# EAGLE design UTAP2022_DAUGHTER_v1.1 (EAGLE 7.5.0)
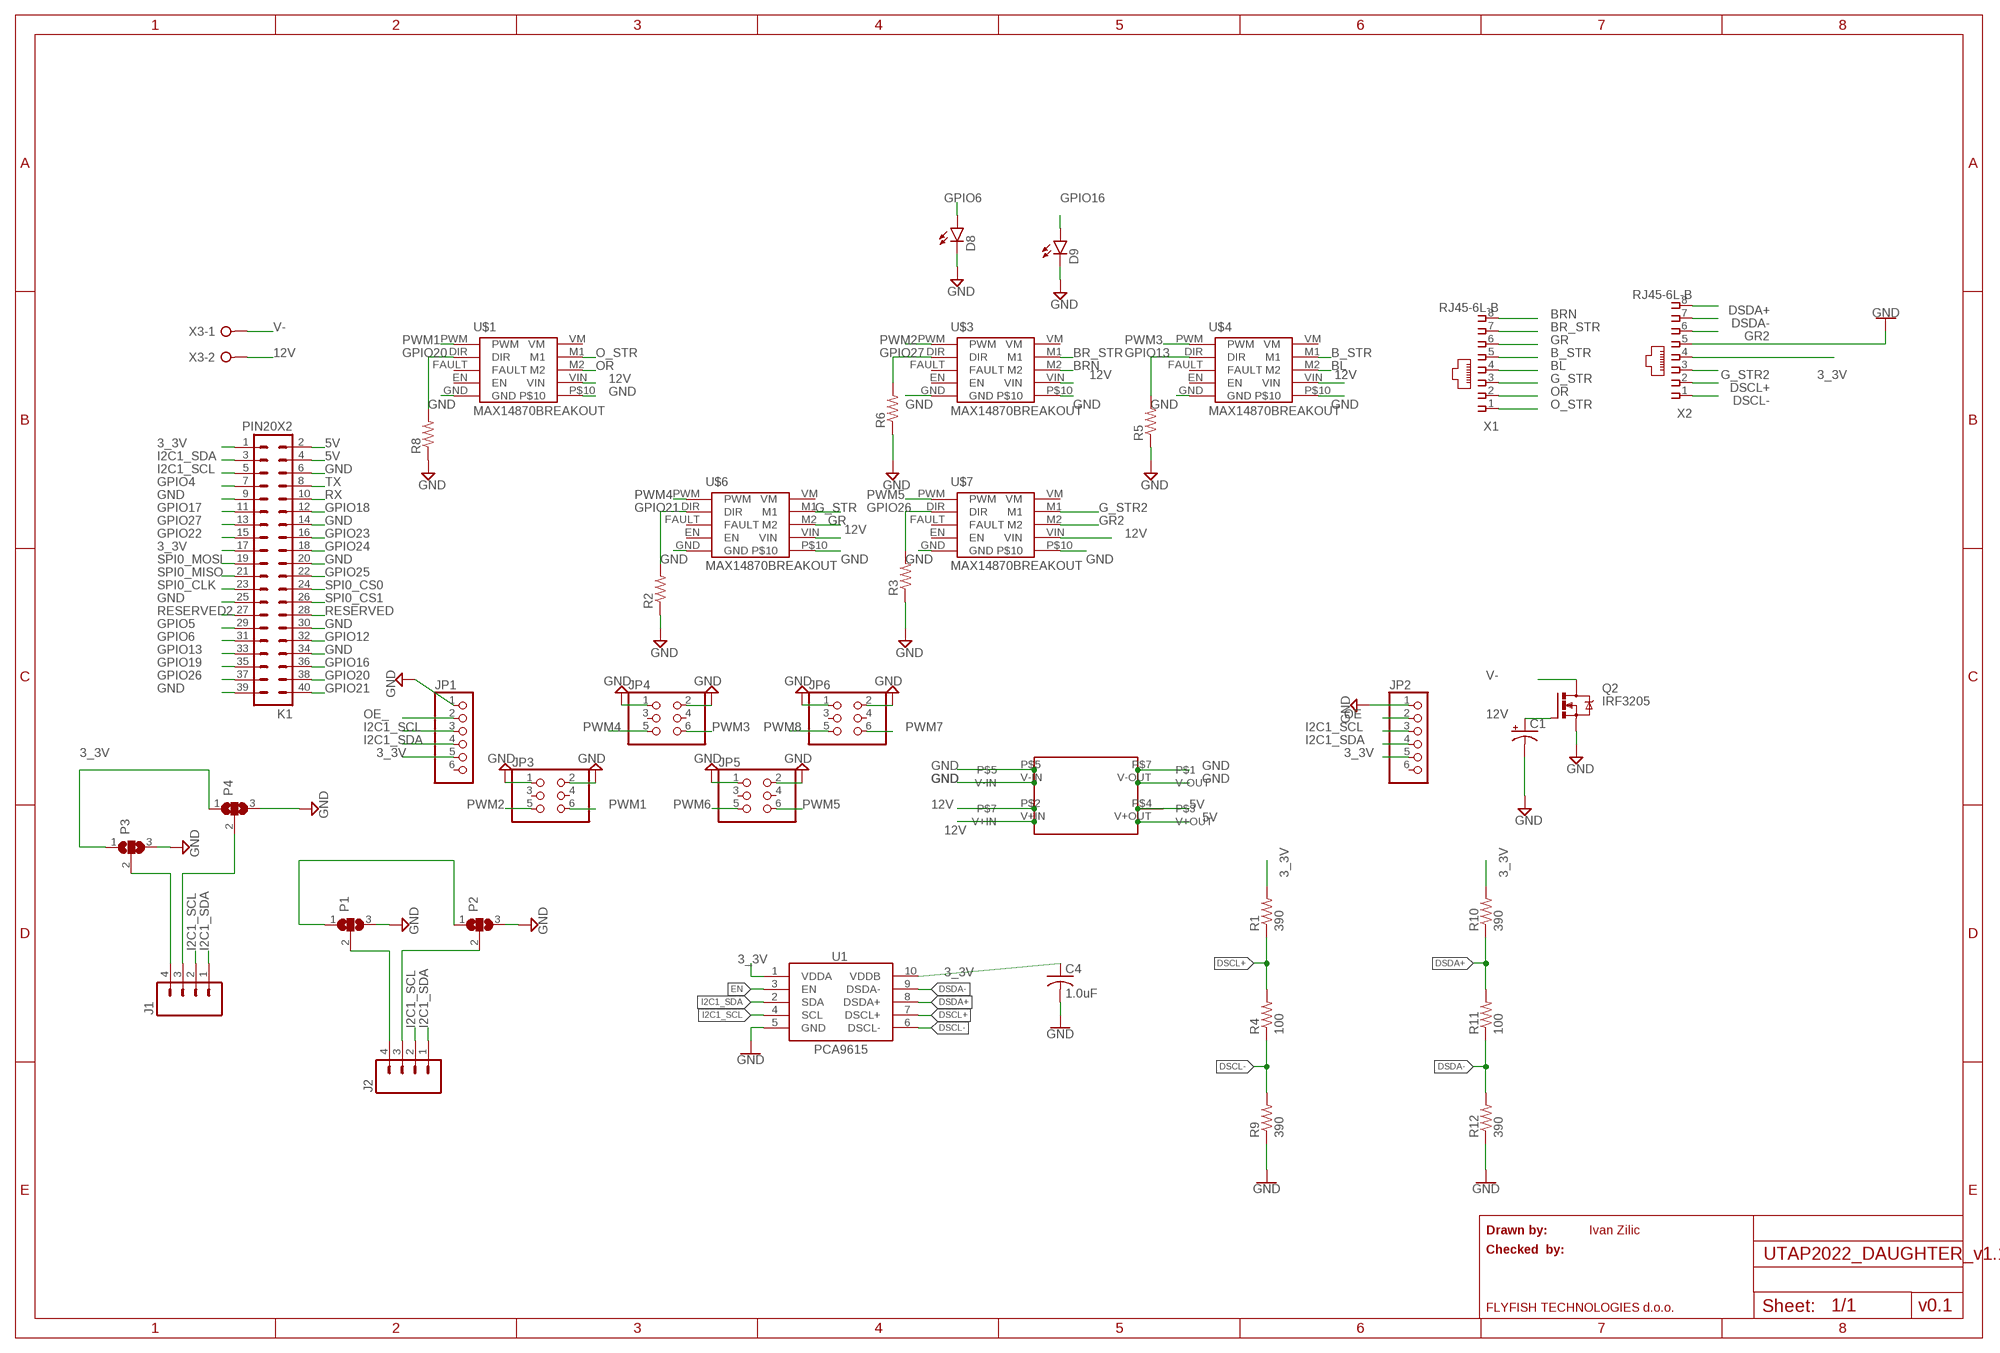
[diagram p0: schematic, sheet 1]

## Parts
C1  CAP_POLPTH1  [CPOL-RADIAL-100UF-25V]
C4  1.0uF  C-US050-024X044  [C050-024X044]
D8  LED5MM  [LED5MM]
D9  LED5MM  [LED5MM]
J1  M04PTH  [1X04]
J2  M04PTH  [1X04]
JP1  PINHD-1X6  [1X06]
JP2  PINHD-1X6  [1X06]
JP3  PINHD-2X3  [2X03]
JP4  PINHD-2X3  [2X03]
JP5  PINHD-2X3  [2X03]
JP6  PINHD-2X3  [2X03]
K1  PIN20X2  [PIN_20X2]
P1  SJ2W  [SJ_2]
P2  SJ2W  [SJ_2]
P3  SJ2W  [SJ_2]
P4  SJ2W  [SJ_2]
Q2  IRF3205  IRF540  [TO220BV]
R1  390  R-US_0204/7  [0204/7]
R2  R-US_0204/7  [0204/7]
R3  R-US_0204/7  [0204/7]
R4  100  R-US_0204/7  [0204/7]
R5  R-US_0204/7  [0204/7]
R6  R-US_0204/7  [0204/7]
R8  R-US_0204/7  [0204/7]
R9  390  R-US_0204/7  [0204/7]
R10  390  R-US_0204/7  [0204/7]
R11  100  R-US_0204/7  [0204/7]
R12  390  R-US_0204/7  [0204/7]
U1  PCA9615  [TSSOP10]
U$1  MAX14870BREAKOUT  [MAX14870_BREAKOUT]
U$3  MAX14870BREAKOUT  [MAX14870_BREAKOUT]
U$4  MAX14870BREAKOUT  [MAX14870_BREAKOUT]
U$6  MAX14870BREAKOUT  [MAX14870_BREAKOUT]
U$7  MAX14870BREAKOUT  [MAX14870_BREAKOUT]
U$9  MP1584EN  [BUCK_CONV]
X1  RJ45-6L-B  [RJ45-NO-SHIELD]
X2  RJ45-6L-B  [RJ45-NO-SHIELD]
X3  W237-02P  [W237-132]

## Nets
3_3V: C4.1 JP1.5 JP2.5 K1.1 K1.17 P1.1 P2.1 P3.1 P4.1 R1.2 R10.2 U1.1(VDDA) U1.10(VDDB) X2.4
5V [5V]: K1.2 K1.4 U$9.P$4 U$9.V+OUT
12V [POWER]: C1.1(+) Q2.G U$1.VIN U$3.VIN U$4.VIN U$6.VIN U$7.VIN U$9.P$2 U$9.V+IN X3.2
B_STR [MOTOR]: U$4.M1 X1.5
BL [MOTOR]: U$4.M2 X1.4
BR_STR [MOTOR]: U$3.M1 X1.7
BRN [MOTOR]: U$3.M2 X1.8
DSCL+: R1.1 R4.2 U1.7(DSCL+) X2.2
DSCL-: R4.1 R9.2 U1.6(DSCL-) X2.1
DSDA+: R10.1 R11.2 U1.8(DSDA+) X2.8
DSDA-: R11.1 R12.2 U1.9(DSDA-) X2.7
EN: U1.3(EN)
G_STR [MOTOR]: U$6.M1 X1.3
G_STR2 [MOTOR]: U$7.M1 X2.3
GND [POWER]: C1.2(-) C4.2 D8.K(C) D9.K(C) JP1.1 JP2.1 JP3.1 JP3.2 JP4.1 JP4.2 JP5.1 JP5.2 JP6.1 JP6.2 K1.6 K1.9 K1.14 K1.20 K1.25 K1.30 K1.34 K1.39 P1.3 P2.3 P3.3 P4.3 Q2.S R2.1 R3.1 R5.1 R6.1 R8.1 R9.1 R12.1 U1.5(GND) U$1.GND U$1.P$10 U$3.GND U$3.P$10 U$4.GND U$4.P$10 U$6.GND U$6.P$10 U$7.GND U$7.P$10 U$9.P$5 U$9.P$7 U$9.V-IN U$9.V-OUT X2.5
GPIO4: K1.7
GPIO5: K1.29
GPIO6: D8.A K1.31
GPIO12: K1.32
GPIO13: K1.33 R5.2 U$4.DIR
GPIO16: D9.A K1.36
GPIO17: K1.11
GPIO18: K1.12
GPIO19: K1.35
GPIO20: K1.38 R8.2 U$1.DIR
GPIO21: K1.40 R2.2 U$6.DIR
GPIO22: K1.15
GPIO23: K1.16
GPIO24: K1.18
GPIO25: K1.22
GPIO26: K1.37 R3.2 U$7.DIR
GPIO27: K1.13 R6.2 U$3.DIR
GR [MOTOR]: U$6.M2 X1.6
GR2 [MOTOR]: U$7.M2 X2.6
I2C1_SCL: J1.2 J2.2 JP1.3 JP2.3 K1.5 U1.4(SCL)
I2C1_SDA: J1.1 J2.1 JP1.4 JP2.4 K1.3 U1.2(SDA)
N$3: J1.4 P3.2
N$4: J1.3 P4.2
N$5: J2.4 P1.2
N$6: J2.3 P2.2
O_STR [MOTOR]: U$1.M1 X1.1
OE: JP2.2
OE_: JP1.2
OR [MOTOR]: U$1.M2 X1.2
PWM1: JP3.6 U$1.PWM
PWM2: JP3.5 U$3.PWM
PWM3: JP4.6 U$4.PWM
PWM4: JP4.5 U$6.PWM
PWM5: JP5.6 U$7.PWM
PWM6: JP5.5
PWM7: JP6.6
PWM8: JP6.5
RESERVED: K1.28
RESERVED2: K1.27
RX: K1.10
SPI0_CLK: K1.23
SPI0_CS0: K1.24
SPI0_CS1: K1.26
SPI0_MISO: K1.21
SPI0_MOSI: K1.19
TX: K1.8
V- [POWER]: Q2.D X3.1
Unconnected: JP1.6 JP2.6 JP3.3 JP3.4 JP4.3 JP4.4 JP5.3 JP5.4 JP6.3 JP6.4 U$1.EN U$1.FAULT U$1.VM U$3.EN U$3.FAULT U$3.VM U$4.EN U$4.FAULT U$4.VM U$6.EN U$6.FAULT U$6.VM U$7.EN U$7.FAULT U$7.VM

## Notes on the sheet
- Drawn by: | Ivan Zilic
- Checked  by:
- FLYFISH TECHNOLOGIES d.o.o. | v0.1

## Library data of the parts
C1 = SparkFun-Passives:CAP_POL: Capacitor Polarized These are standard SMD and PTH capacitors. Normally 10uF, 47uF, and 100uF in electrolytic and tantalum varieties. Always verify the external diameter of the through hole cap, it varies with capacity, voltage, and manufacturer. The EIA devices should be standard.
C4 = rcl:C-US: CAPACITOR, American symbol
D8 D9 = SparkFun-LED:LED: LEDs Standard schematic elements and footprints for 5mm, 3mm, 1206, and 0603 sized LEDs. 5mm - Spark Fun Electronics SKU : COM-00529 (and others)
J1 J2 = SparkFun-Connectors:M04: Header 4 Standard 4-pin 0.1" header. Use with straight break away headers (SKU : PRT-00116), right angle break away headers (PRT-00553), swiss pins (PRT-00743), machine pins (PRT-00117), and female headers (PRT-00115). Molex polarized connector foot print use with SKU : PRT-08231 with associated crimp pins and housings. 1MM SMD Version SKU: PRT-10208; PROD_ID: CONN-09696
JP1 JP2 = pinhead:PINHD-1X6: PIN HEADER
JP3-JP6 = pinhead:PINHD-2X3: PIN HEADER
K1 = FLYFISH:PIN20X2
P1-P4 = jumper:SJ2W: SMD solder JUMPER
Q2 = transistor-power:IRF540: HEXFET Power MOSFET
R1-R6 R8-R12 = resistor:R-US_: RESISTOR, American symbol
U1 = SparkFun-IC-Comms:PCA9615: Differential I2C Bus Buffer Datasheet <https://www.nxp.com/docs/en/data-sheet/PCA9615.pdf>; PROD_ID: IC-13899
U$1 U$3 U$4 U$6 U$7 = MAX14870_BREAKOUT:MAX14870BREAKOUT
U$9 = MP1584EN:MP1584EN
X1 X2 = con-tycoelectronics:RJ45: CORCOM Modular RJ Jacks No Shield Source: www.tycoelectronics.com .. ENG_DS_1654001_1099_RJ_L_0507.pdf; MPN: RJ45-6L-B; OC_FARNELL: unknown; OC_NEWARK: 16R6090
X3 = con-wago-508:W237-02P: WAGO SREW CLAMP; OC_FARNELL: unknown; OC_NEWARK: unknown

## Net classes
0 default: width 0.254 mm, clearance 0.254 mm
1 POWER: width 2.032 mm, clearance 0.254 mm
2 MOTOR: width 1.016 mm, clearance 0.254 mm
3 5V: width 0.508 mm, clearance 0.254 mm

## Board
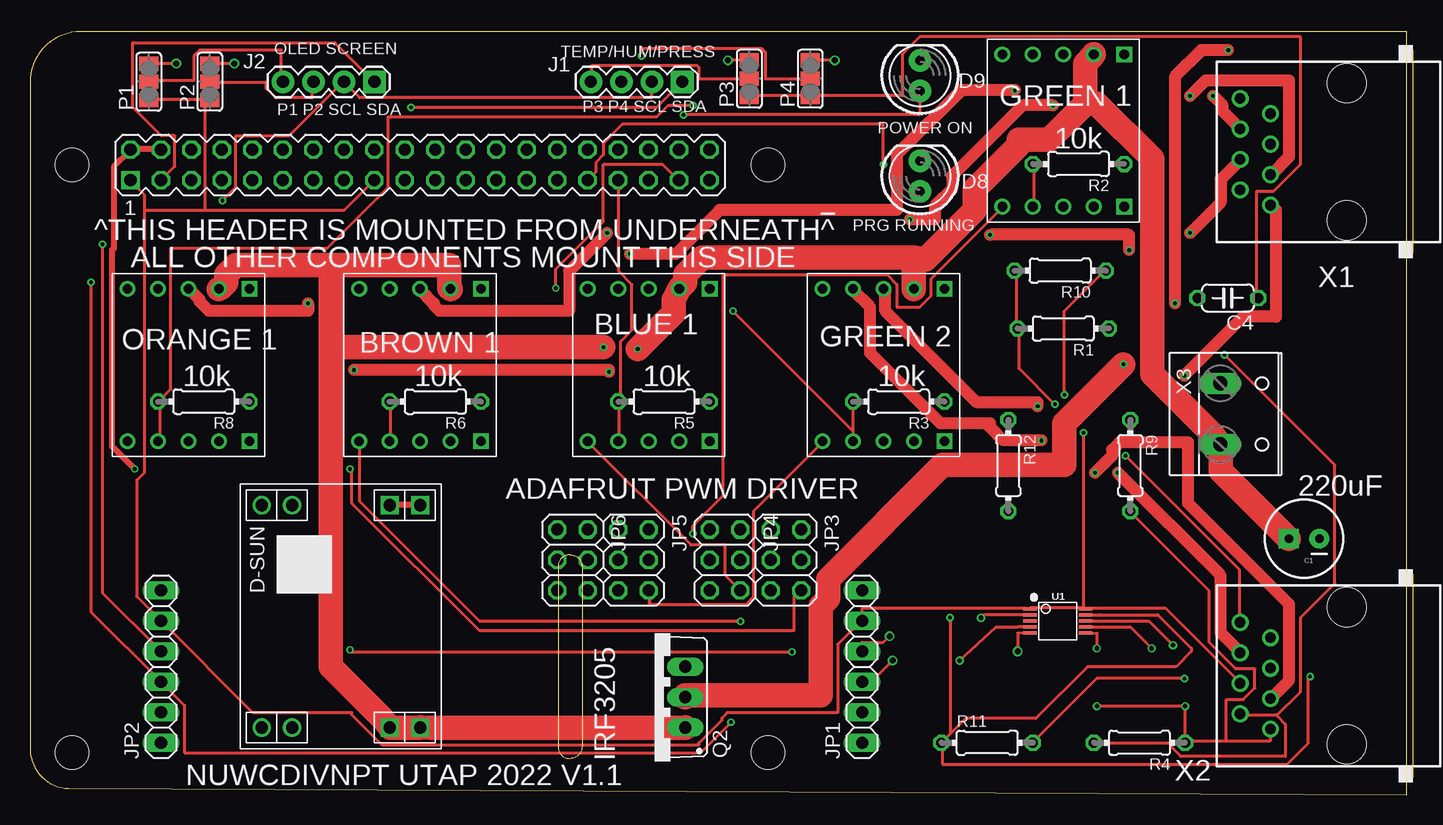
[diagram p1: board, top side]
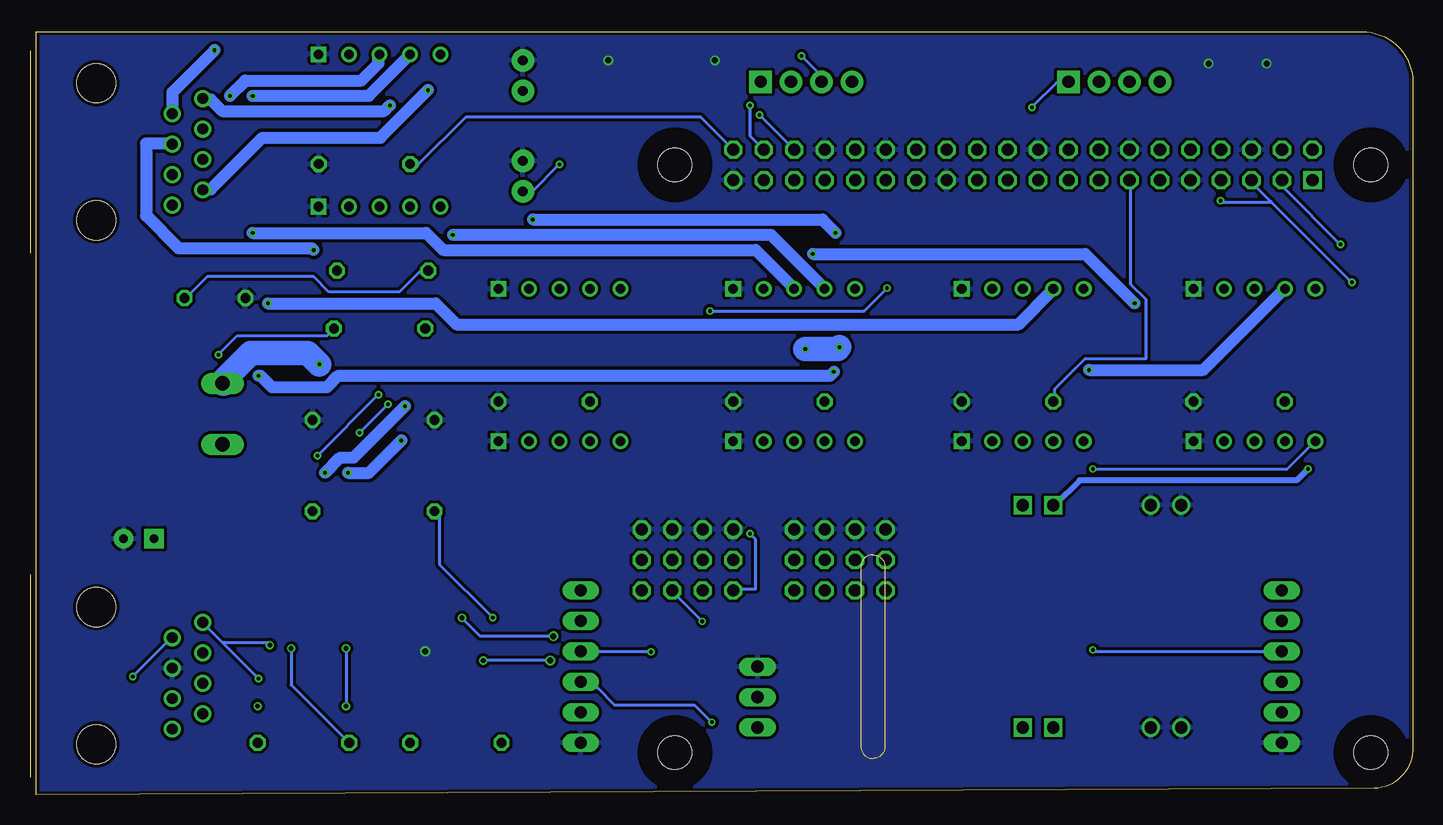
[diagram p2: board, bottom side, seen from below]

Size 114.72 x 63.62 mm. Coordinates in mm from the lower left corner, seen from the top.
Outline: 114.72,0 114.72,63.62 4.24,63.62 arc90 0,59.38 0,3.98 arc90 3.21,0.51 114.72,0
Copper layers (1*16): Top 0.035mm / dielectric 1.5mm / Bottom 0.035mm
Design rules "ITEADstudio_DRC *": minimum track width 6mil, minimum drill 12mil, track to track 6mil, track to pad 6mil, pad to pad 6mil, via to via 6mil, smd to smd 0mil, copper to edge 11mil, drill to drill 11mil, minimum pad ring 10mil, minimum via ring 6mil, stop-mask expansion 2mil, vias tented up to drill 100mil, thermal gap 10mil
Holes 2.8 mm at 3.5,3.5 3.5,52.5 61.5,52.5 61.5,3.5
tRestrict: area 1.9,51 to 5,54; area 60,51 to 63,54; area 60,1.9 to 63,5; area 1.9,1.9 to 5,5
bRestrict: area 1.9,1.9 to 5,5; area 1.9,51 to 5,54; area 60,1.9 to 63,5; area 60,51 to 63,54
Milling: 6 lines

### Footprints (pad centres in the part's own frame; a part is rotated, then mirrored left to right if it is on the bottom)
CPOL-RADIAL-100UF-25V = drill 0.7 pad 1.651 square: 1 1.27,0 | drill 0.7 pad 1.651: 2 -1.27,0
C050-024X044 = drill 0.813 octagon: 1 -2.54,0; 2 2.54,0
LED5MM = drill 0.813 pad 1.88: A -1.27,0; K 1.27,0
1X04 = drill 1.016 pad 1.88 square: 1 0,0 | drill 1.016 pad 1.88: 2 2.54,0; 3 5.08,0; 4 7.62,0
1X06 = drill 1.016 long: 1 -6.35,0; 2 -3.81,0; 3 -1.27,0; 4 1.27,0; 5 3.81,0; 6 6.35,0
2X03 = drill 1.016 octagon: 1 -2.54,-1.27; 2 -2.54,1.27; 3 0,-1.27; 4 0,1.27; 5 2.54,-1.27; 6 2.54,1.27
PIN_20X2 = drill 1.016 square: 1 -24.13,-1.27 | drill 1.016 octagon: 2 -24.13,1.27; 3 -21.59,-1.27; 4 -21.59,1.27; 5 -19.05,-1.27; 6 -19.05,1.27; 7 -16.51,-1.27; 8 -16.51,1.27; 9 -13.97,-1.27; 10 -13.97,1.27; 11 -11.43,-1.27; 12 -11.43,1.27; 13 -8.89,-1.27; 14 -8.89,1.27; 15 -6.35,-1.27; 16 -6.35,1.27; 17 -3.81,-1.27; 18 -3.81,1.27; 19 -1.27,-1.27; 20 -1.27,1.27; 21 1.27,-1.27; 22 1.27,1.27; 23 3.81,-1.27; 24 3.81,1.27; 25 6.35,-1.27; 26 6.35,1.27; 27 8.89,-1.27; 28 8.89,1.27; 29 11.43,-1.27; 30 11.43,1.27; 31 13.97,-1.27; 32 13.97,1.27; 33 16.51,-1.27; 34 16.51,1.27; 35 19.05,-1.27; 36 19.05,1.27; 37 21.59,-1.27; 38 21.59,1.27; 39 24.13,-1.27; 40 24.13,1.27
SJ_2 = smd 1.168 x 1.6: 1 -1.524,0; 2 0,0; 3 1.524,0
TO220BV = drill 1.016 long: D 0,-2.54; G -2.54,-2.54; S 2.54,-2.54
0204/7 = drill 0.813 octagon: 1 -3.81,0; 2 3.81,0
TSSOP10 = smd 1.1 x 0.25: 1 -2.259,1.018; 2 -2.259,0.517; 3 -2.259,0.018; 4 -2.259,-0.482; 5 -2.259,-0.988; 6 2.366,-0.988; 7 2.366,-0.482; 8 2.366,0.018; 9 2.366,0.517; 10 2.366,1.018
MAX14870_BREAKOUT = drill 0.8: DIR -6.35,2.54; EN -6.35,-2.54; FAULT -6.35,0; M1 6.35,2.54; M2 6.35,0; PWM -6.35,5.08; VIN 6.35,-2.54; VM 6.35,5.08 | drill 0.8 square: GND -6.35,-5.08; P$10 6.35,-5.08
BUCK_CONV = drill 1.016 square: P$2 1.778,4.318; P$4 20.32,4.318; V+IN 1.778,1.778; V+OUT 20.32,1.778 | drill 1.016: P$5 1.778,14.986; P$7 20.32,14.986; V-IN 1.778,12.446; V-OUT 20.32,12.446
RJ45-NO-SHIELD = drill 0.9 pad 1.4: 1 -4.445,6.35; 2 -3.175,8.89; 3 -1.905,6.35; 4 -0.635,8.89; 5 0.635,6.35; 6 1.905,8.89; 7 3.175,6.35; 8 4.445,8.89 | hole 3.251: -5.715,0; 5.715,0
W237-132 = drill 1.194 long: 1 -2.54,-0.635; 2 2.54,-0.635

### Placement (x,y rotation side)
C1  106.17,21.34 180 top
C4  99.82,41.4 180 top
D8  74.17,51.56 90 top
D9  74.17,59.94 90 top
J1  54.36,59.44 180 top
J2  28.7,59.44 180 top
JP1  69.34,10.67 90 top
JP2  10.92,10.67 90 top
JP3  62.99,19.56 270 top
JP4  57.91,19.56 270 top
JP5  50.29,19.56 270 top
JP6  45.21,19.56 270 top
K1  32.5,52.5 0 top
P1  9.91,59.44 90 top
P2  14.99,59.44 90 top
P3  59.94,59.69 90 top
P4  65.02,59.69 90 top
Q2  52.07,8.13 90 top
R1  86.11,38.86 180 top
R2  87.38,52.58 180 top
R3  72.39,32.77 180 top
R4  92.46,4.32 180 top
R5  52.83,32.77 180 top
R6  33.78,32.77 180 top
R8  14.48,32.77 180 top
R9  91.69,27.43 270 top
R10  85.85,43.69 180 top
R11  79.76,4.32 0 top
R12  81.53,27.43 270 top
U1  85.6,14.48 0 top
U$1  13.21,35.81 90 top
U$3  32.51,35.81 90 top
U$4  51.56,35.81 90 top
U$6  86.11,55.37 90 top
U$7  71.12,35.81 90 top
U$9  34.29,3.81 90 top
X1  109.73,53.59 90 top
X2  109.73,9.91 90 top
X3  99.82,31.75 270 top

### Tracks (layer width: path | path; a pad name or v marks a point on that pad's centre or on a via)
3_3V  (via drill 0.3)
  Top 0.254: P1.1 10,57.94 14.92,57.94 P2.1 14.92,57.78 14.61,57.47 14.61,48.74 | 9.53,48.74 9.53,50.01 8.41,51.12 K1.1 | 9.53,48.74 9.53,26.83 8.89,26.19 8.89,16.51 JP2.5 18.57,6.83 26.83,6.83 26.83,6.67 29.37,4.13 55.72,4.13 55.72,4.29 57.63,6.19 57.63,6.35 58.1,6.83 67.31,6.83 67.31,12.54 69.22,14.45 JP1.5 69.37,14.61 69.37,15.56 82.93,15.56 U1.1 83.34,15.56 87.79,15.56 | 9.53,48.74 14.61,48.74 | 14.61,48.74 26.19,48.74 28.57,51.12 K1.17 | 87.79,15.56 87.95,15.56 U1.10 | X2.4 100.81,9.37 94.61,15.56 88.11,15.56 U1.10 | P3.1 60.01,58.26 64.93,58.26 P4.1 65.09,58.26 72.71,58.26 72.71,61.75 74.14,63.18 105.89,63.18 105.89,52.55 103.66,50.32 102.23,50.32 102.23,41.43 C4.1 | R10.2 82.23,43.5 82.23,38.89 R1.2 82.39,38.73 82.39,35.56 v85.41,32.54 | v87.79,30.16 87.79,15.56 | 87.79,15.56 U1.10
  Bottom 0.254: C4.1 102.23,41.43 100.49,43.18 91.6,43.18 90.33,41.91 84.45,41.91 82.71,43.66 82.07,43.66 R10.2 | v85.41,32.54 v87.79,30.16
5V  (via drill 0.3)
  Top 0.508: U$9.V+OUT U$9.P$4 | K1.4 10.79,53.82 8.41,53.82 K1.2 8.26,53.66 6.99,52.39 6.99,45.56 6.83,45.4 6.83,29.05 v8.73,27.15
  Bottom 0.508: v8.73,27.15 9.68,26.19 27.78,26.19 29.84,24.13 U$9.P$4
12V  (via drill 0.3)
  Top 2.032: 25.08,44.13 34.92,44.13 34.92,42.23 U$3.VIN | 25.08,44.13 17.14,44.13 16.35,43.34 16.35,42.7 15.88,42.23 U$1.VIN | 30,5.56 32.38,5.56 U$9.V+IN 33.5,5.56 54.61,5.56 Q2.G | 30,5.56 U$9.P$2 | 25.08,37.31 25.08,10.64 29.37,6.35 30,5.56 | 25.08,37.31 25.08,44.13 | C1.1 104.78,21.43 99.22,26.99 99.22,29.21 X3.2 98.58,30 93.5,35.08 93.5,53.02 88.9,57.63 87.95,57.63 | 73.66,44.77 56.04,44.77 54.61,43.34 54.61,42.7 54.13,42.23 U$4.VIN 53.66,41.27 53.66,40.16 v50.64,37.15 | U$7.VIN 73.66,44.77 | 87.95,57.63 87.95,60.96 88.58,61.59 U$6.VIN | 87.95,57.63 84.93,54.61 82.39,54.61 82.39,54.13 78.74,50.48 78.74,48.74 74.61,44.61 73.66,44.77 | v47.78,37.31 25.08,37.31
  Bottom 2.032: v47.78,37.31 47.94,37.15 v50.64,37.15
B_STR  (via drill 0.3)
  Top 1.016: v80.01,46.67 91.6,46.67 v91.6,45.4
  Bottom 1.016: v80.01,46.67 53.5,46.67 49.05,42.23 U$4.M1 | v91.6,45.4 91.76,45.56 102.87,45.56 105.57,48.26 105.57,54.29 103.5,54.29 X1.5
BL  (via drill 0.3)
  Top 1.016: v96.68,46.83 99.22,49.37 99.22,51.28 100.81,52.86 X1.4
  Bottom 1.016: v96.68,46.83 82.23,46.83 80.8,45.4 54.77,45.4 51.59,42.23 U$4.M2
BR_STR  (via drill 0.3)
  Top 1.016: v95.41,40.96 95.41,59.85 97.63,62.07 v99.85,62.07
  Bottom 1.016: v95.41,40.96 81.44,40.96 79.69,39.21 32.86,39.21 30,42.07 U$3.M1 | v99.85,62.07 103.35,58.58 103.35,56.83 X1.7
BRN  (via drill 0.3)
  Top 1.016: v48.1,46.83 44.93,43.66 44.93,40.32 34.13,40.32 33.66,40.8 33.66,40.96 32.54,42.07 U$3.M2 | v73.34,47.94 75.41,47.94 75.41,49.05 76.83,50.48 76.83,51.59 82.71,57.47 v85.25,57.47
  Bottom 1.016: v48.1,46.83 49.21,47.94 v73.34,47.94 | v85.25,57.47 85.72,56.99 99.22,56.99 100.17,57.94 100.81,57.94 X1.8
DSCL+  (via drill 0.3, 0.38)
  Top 0.254: 103.9,6.59 103.82,6.67 100.97,6.67 X2.2 | 103.9,6.59 104.62,5.87 104.62,3.17 95.89,3.17 95.09,3.97 95.09,4.29 88.74,4.29 R4.2 | v99.54,36.67 108.74,27.46 108.74,17.62 105.89,14.76 105.89,8.57 103.9,6.59 | v93.47,12.19 91.69,13.97 89.15,13.97 U1.7
  Bottom 0.254: v99.54,36.67 97.95,38.26 90.49,38.26 90.01,38.73 R1.1 | v93.47,12.19 93.47,9.14 R4.2
DSCL-  (via drill 0.38)
  Top 0.254: 99.69,4.45 103.35,4.45 103.35,5.4 X2.1 | 99.69,4.45 96.36,4.45 R4.1 96.27,7.37 v88.9,7.37 | 99.69,4.45 99.69,7.94 101.12,7.94 102.08,8.89 102.08,10.48 100.49,10.48 98.27,12.7 98.27,16.99 91.76,23.5 R9.2 | v88.9,12.19 88.9,13.46 U1.6
  Bottom 0.254: v88.9,12.19 v88.9,7.37
DSDA+  (via drill 0.3, 0.38)
  Top 0.254: v96.2,9.68 88.9,9.68 83.66,4.45 R11.2 | v86.2,33.34 86.2,40.32 89.53,43.66 R10.1 | v91.28,28.26 100.81,18.73 100.81,14.45 X2.8 | v95.25,12.45 93.22,14.48 89.15,14.48 U1.8
  Bottom 0.254: 99.14,12.62 100.81,14.29 X2.8 | 99.14,12.62 v96.2,9.68 | v91.28,28.26 v86.2,33.34 | v95.25,12.45 95.25,12.7 99.06,12.7 99.14,12.62
DSDA-  (via drill 0.3)
  Top 0.254: v76.68,14.76 76.68,5.08 76.04,4.45 R11.1 | v106.68,9.84 106.52,9.68 106.52,4.29 104.78,2.54 76.04,2.54 76.04,4.29 R11.1 | R11.1 77.98,6.35 83.82,6.35 88.14,10.67 95.5,10.67 96.77,11.94 96.77,12.19 93.98,14.99 89.15,14.99 U1.9
  Bottom 0.254: v76.68,14.76 81.12,19.21 81.12,23.5 81.44,23.5 R12.2 | v106.68,9.84 103.5,13.02 X2.7
G_STR  (via drill 0.3)
  Top 1.016: v96.68,58.26 97.95,59.53 104.93,59.53 104.93,53.18 103.5,51.75 X1.3
  Bottom 1.016: v96.68,58.26 87,58.26 83.66,61.59 U$6.M1
G_STR2  (via drill 0.3)
  Top 1.016: v84.3,29.53 81.12,29.53 80.01,30.64 80.01,30.96 75.88,30.96 70.01,36.83 70.01,40.64 68.58,42.07 U$7.M1 | v88.74,26.83 90.17,28.26 90.17,28.73 90.81,29.37 96.52,29.37 96.52,24.29 104.93,15.88 104.93,9.53 103.5,8.1 X2.3
  Bottom 1.016: v84.3,29.53 87,26.83 v88.74,26.83
GND  (via drill 0.5)
  Top 0.254: v82.3,11.94 82.3,13.46 U1.5 | v12.19,60.96 P1.3 | v17.02,60.96 P2.3 | P3.3 v58.17,61.21 | v67.06,61.21 P4.3
  pour Bottom: 0.51,3.1 0.51,60.55 arc-90 3.21,63.25 114.3,63.25 114.3,0 3.61,0 arc-90
GPIO6  (via drill 0.3)
  Top 0.254: v71.12,52.55 71.12,55.88 49.37,55.88 47.78,54.29 47.78,53.34 47.15,52.7 47.15,51.91 46.51,51.28 K1.31
  Bottom 0.254: v71.12,52.55 73.34,50.32 74.14,50.32 D8.A
GPIO13
  Top 0.254: U$4.DIR 49.05,29.53 49.05,32.7 R5.2 49.05,32.86 49.21,33.02 49.21,37.78 50.16,38.73 50.16,42.55 49.05,43.66 49.05,51.12 K1.33
GPIO16  (via drill 0.3)
  Top 0.254: v54.45,56.67 74.14,56.67 74.14,58.58 D9.A
  Bottom 0.254: v54.45,56.67 51.59,53.82 K1.36
GPIO20  (via drill 0.3)
  Top 0.254: U$1.DIR 10.79,29.53 10.79,32.7 R8.2 10.79,32.86 11.75,33.81 11.75,45.56 24.77,45.56 29.84,50.64 29.84,56.52 52.23,56.52 53.18,57.47 v55.24,57.47
  Bottom 0.254: v55.24,57.47 55.24,54.93 54.13,53.82 K1.38
GPIO21
  Top 0.254: U$6.DIR 83.66,49.05 83.66,52.55 R2.2
  Bottom 0.254: K1.40 56.67,53.82 59.37,56.52 78.9,56.52 82.87,52.55 83.5,52.55 R2.2
GPIO26  (via drill 0.3)
  Top 0.254: R3.2 68.58,30.32 | 68.58,30.32 U$7.DIR | v43.81,42.23 43.81,43.81 47.78,47.78 47.78,52.55 52.7,52.55 53.98,51.28 K1.37 | 68.58,30.32 v58.58,40.32
  Bottom 0.254: v43.81,42.23 45.72,40.32 v58.58,40.32
GPIO27
  Top 0.254: U$3.DIR 30,29.53 30,32.7 R6.2
  Bottom 0.254: K1.13 23.5,51.12 23.5,42.55 22.23,41.27 22.23,36.35 27.3,36.35 29.84,33.81 29.84,32.86 R6.2
GR  (via drill 0.3)
  Top 1.016: v98.58,58.26 99.38,57.47 99.38,56.99 100.81,55.56 X1.6
  Bottom 1.016: v98.58,58.26 97.31,59.53 87.63,59.53 86.2,60.96 86.2,61.59 U$6.M2
GR2  (via drill 0.3)
  Top 1.016: v83.98,32.38 83.98,32.7 78.9,32.7 71.28,40.32 71.28,41.91 71.12,42.07 U$7.M2 | v90.65,26.83 99.22,18.26 99.22,13.49 100.81,11.91 X2.6
  Bottom 1.016: v83.98,32.38 88.27,28.1 89.38,28.1 v90.65,26.83
I2C1_SCL  (via drill 0.3, 0.38, 0.5)
  Top 0.254: J1.2 51.75,59.37 51.75,58.1 27.46,58.1 26.19,59.37 J2.2 26.04,59.37 21.59,54.93 17.14,54.93 17.14,50.64 v16.03,49.53 | v5.08,42.7 5.08,15.24 JP2.3 12.86,7.46 12.86,3.49 55.88,3.49 v58.42,6.03 | v77.47,11.18 80.52,13.97 82.3,13.97 U1.4 | v71.88,11.18 70.61,9.91 69.34,9.91 JP1.3
  Bottom 0.254: 11.83,49.45 13.49,51.12 K1.5 | 11.83,49.45 v5.08,42.7 | v58.42,6.03 59.85,7.46 66.52,7.46 67.94,8.89 68.74,8.89 69.22,9.37 JP1.3 | v16.03,49.53 15.88,49.37 11.91,49.37 11.83,49.45 | v71.88,11.18 v77.47,11.18
I2C1_SDA  (via drill 0.3, 0.38, 0.5)
  Top 0.254: JP2.4 6.03,16.83 v6.03,45.88 | v63.5,11.91 26.67,11.91 v26.67,12.06 | J2.1 28.57,59.53 25.4,62.71 8.57,62.71 8.57,57.31 10.95,54.93 12.06,54.93 12.06,52.39 10.95,51.28 K1.3 | J1.1 52.23,57.31 v31.75,57.31 | v71.63,13.21 71.12,12.7 69.34,12.7 JP1.4 | v79.25,14.73 79.5,14.99 82.3,14.99 U1.2
  Bottom 0.254: v6.03,45.88 10.79,50.64 10.79,51.12 K1.3 | v63.5,11.91 69.22,11.91 JP1.4 | v26.67,12.06 26.51,11.91 10.95,11.91 JP2.4 | v31.75,57.31 29.69,59.37 28.73,59.37 J2.1 | v79.25,14.73 77.72,13.21 v71.63,13.21
N$3
  Top 0.254: P3.2 55.72,59.69 55.72,60.64 55.56,60.8 46.83,60.8 46.83,59.53 J1.4
N$4  (via drill 0.3)
  Top 0.254: P4.2 61.28,59.69 61.28,61.91 60.96,62.23 50.96,62.23 v50.96,61.59
  Bottom 0.254: v50.96,61.59 49.37,60.01 49.37,59.53 J1.3
N$5
  Top 0.254: P1.2 10,59.53 13.65,59.53 13.65,61.59 14.13,62.07 20.95,62.07 20.95,59.53 J2.4
N$6
  Top 0.254: P2.2 15.08,59.37 19.68,59.37 19.68,58.9 20.48,58.1 23.5,58.1 23.5,59.37 J2.3
N$9  (via drill 0.38)
  other vias: 96.27,7.37
O_STR  (via drill 0.3)
  Top 1.016: v26.99,35.4 48.26,35.4 v48.26,35.24 | v96.2,34.92 101.12,39.85 103.82,39.85 103.82,48.74 103.5,49.05 X1.1
  Bottom 1.016: v26.99,35.4 17.46,35.4 10.79,42.07 U$1.M1 | v48.26,35.24 48.58,34.92 89.53,34.92 90.49,33.97 95.09,33.97 96.04,34.92 v96.2,34.92
OR  (via drill 0.3)
  Top 1.016: v23.18,40.96 23.18,40.32 14.92,40.32 14.13,41.12 14.13,41.27 13.34,42.07 U$1.M2 | v50.01,45.09 53.82,45.09 57.47,48.74 72.23,48.74 72.23,53.34 77.63,58.74 v82.07,58.74
  Bottom 1.016: v23.18,40.96 27.3,45.09 v50.01,45.09 | v82.07,58.74 86.04,54.77 95.89,54.77 100.17,50.48 100.81,50.48 X1.2
PWM1  (via drill 0.3)
  Top 0.254: v26.67,27.15 26.83,26.99 26.83,24.29 37.47,13.65 63.66,13.65 63.66,16.51 64.14,16.99 JP3.6
  Bottom 0.254: v26.67,27.15 10.48,27.15 8.26,29.37 U$1.PWM
PWM2  (via drill 0.3)
  Top 0.254: v59.21,14.45 37.47,14.45 27.46,24.45 27.46,29.37 U$3.PWM
  Bottom 0.254: v59.21,14.45 61.75,16.99 JP3.5
PWM3
  Top 0.254: JP4.6 57.94,18.26 57.94,20.8 55.09,20.8 46.51,29.37 U$4.PWM
PWM4  (via drill 0.3)
  Top 0.254: v55.24,21.75 55.24,22.38 57.78,24.92 57.78,43.34 71.44,43.34 72.23,42.55 72.23,40.64 74.14,40.64 75.09,41.59 75.09,43.02 80.96,48.9 U$6.PWM
  Bottom 0.254: v55.24,21.75 54.77,21.27 54.77,17.14 56.52,17.14 JP4.5
PWM5
  Top 0.254: U$7.PWM 66.04,29.37 60.33,23.65 60.33,16.51 59.69,15.88 51.59,15.88 51.59,16.99 JP5.6
V-  (via drill 0.3)
  Top 2.032: v91.12,35.88 86.2,30.96 86.2,27.46 76.04,27.46 66.52,17.94 66.52,16.35 65.88,15.72 65.88,8.26 54.61,8.26 Q2.D
  Bottom 2.032: v91.12,35.88 92.08,36.83 96.84,36.83 99.06,34.61 99.06,34.29 X3.1

### Text on the board
tNames: OLED SCREEN | TEMP/HUM/PRESS | P3 P4 SCL SDA | P1 P2 SCL SDA | GREEN 1 | POWER ON | 10k | PRG RUNNING | ^THIS HEADER IS MOUNTED FROM UNDERNEATH!^ | ALL OTHER COMPONENTS MOUNT THIS SIDE | BLUE 1 | ORANGE 1 | BROWN 1 | GREEN 2 | 10k | 10k | 10k | 10k | ADAFRUIT PWM DRIVER | 220uF | IRF3205 | NUWCDIVNPT UTAP 2022 V1.1
bValues: ONLY THE 40 PIN HEADER IS CONNECTED TO THIS SIDE!!!